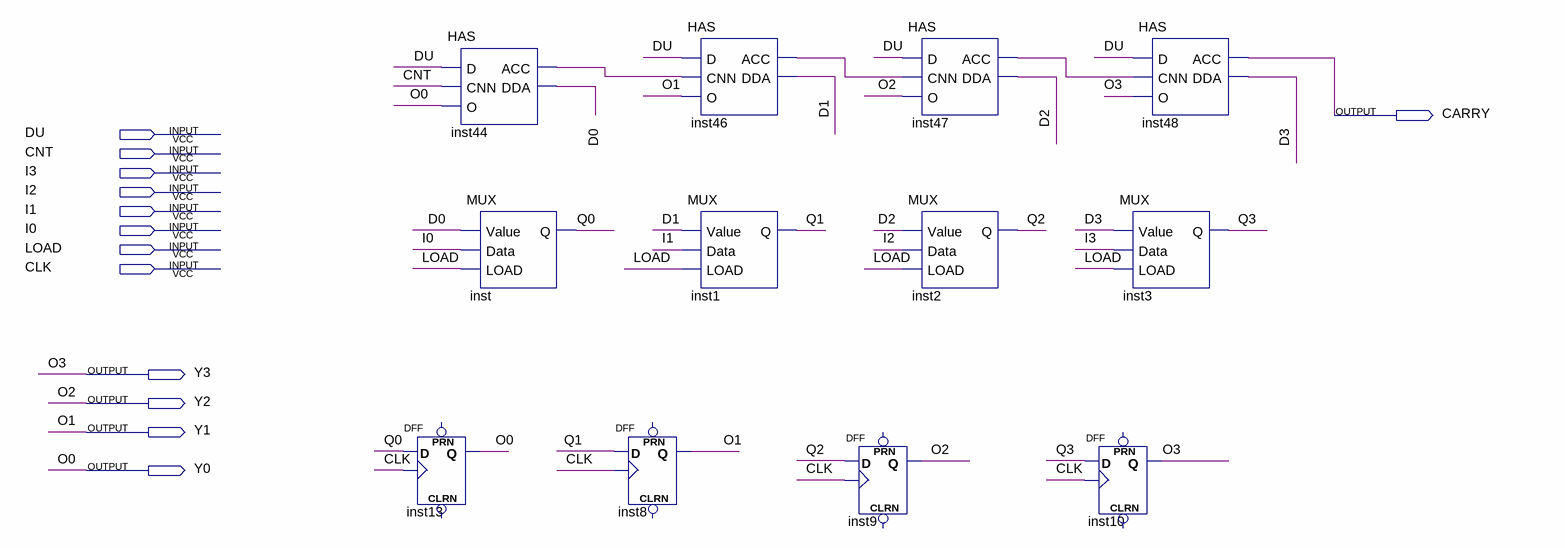
[diagram p0: schematic sheet]
// Quartus schematic SRwPL.bdf as structural Verilog: 12 symbols, 13 pins
module SRwPL (
  input  DU,
  input  CNT,
  input  I3,
  input  I2,
  input  I1,
  input  I0,
  input  LOAD,
  input  CLK,
  output CARRY,
  output Y3,
  output Y2,
  output Y1,
  output Y0
);

  wire D0, D1, D2, D3, inst44_acc, inst46_acc, inst47_acc, Q0, Q1, Q2, Q3;

  HAS inst44 (.D(DU), .CNN(CNT), .O(Y0), .ACC(inst44_acc), .DDA(D0));
  MUX inst (.Value(D0), .Data(I0), .LOAD(LOAD), .Q(Q0));
  DFF inst13 (.CLK(CLK), .D(Q0), .Q(Y0));  // open: CLRN, PRN
  DFF inst8 (.CLK(CLK), .D(Q1), .Q(Y1));  // open: CLRN, PRN
  HAS inst46 (.D(DU), .CNN(inst44_acc), .O(Y1), .ACC(inst46_acc), .DDA(D1));
  MUX inst1 (.Value(D1), .Data(I1), .LOAD(LOAD), .Q(Q1));
  DFF inst9 (.CLK(CLK), .D(Q2), .Q(Y2));  // open: CLRN, PRN
  HAS inst47 (.D(DU), .CNN(inst46_acc), .O(Y2), .ACC(inst47_acc), .DDA(D2));
  MUX inst2 (.Value(D2), .Data(I2), .LOAD(LOAD), .Q(Q2));
  HAS inst48 (.D(DU), .CNN(inst47_acc), .O(Y3), .ACC(CARRY), .DDA(D3));
  MUX inst3 (.Value(D3), .Data(I3), .LOAD(LOAD), .Q(Q3));
  DFF inst10 (.CLK(CLK), .D(Q3), .Q(Y3));  // open: CLRN, PRN

  // Other names for the same wires on the sheet: O0 = Y0; O1 = Y1; O2 = Y2; O3 = Y3
endmodule
